# Altium schematic sheet [18] - PCIE MINI.SchDoc
size A2; DocumentNumber: 18; SheetNumber: 18; SheetTotal: 31
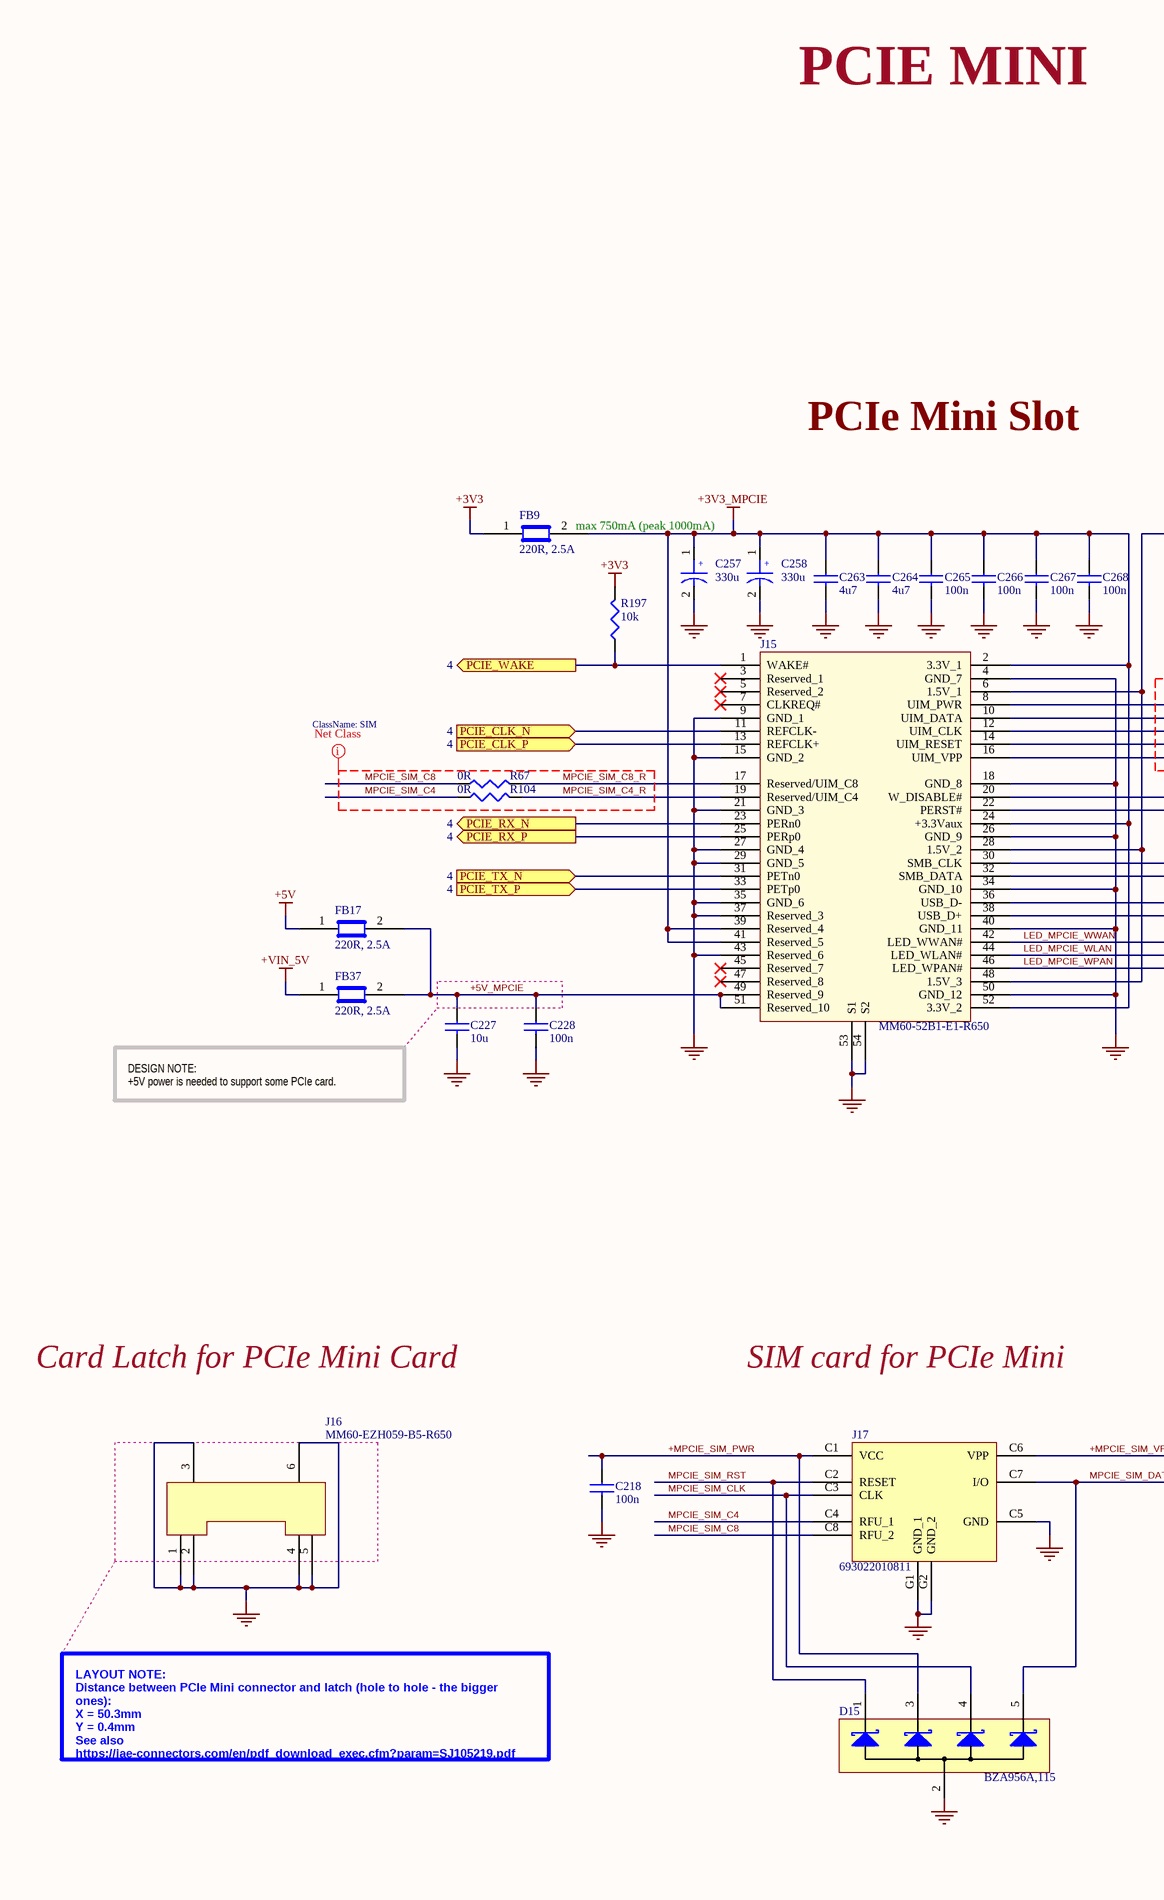
[diagram p0: [18] - PCIE MINI.SchDoc, left]
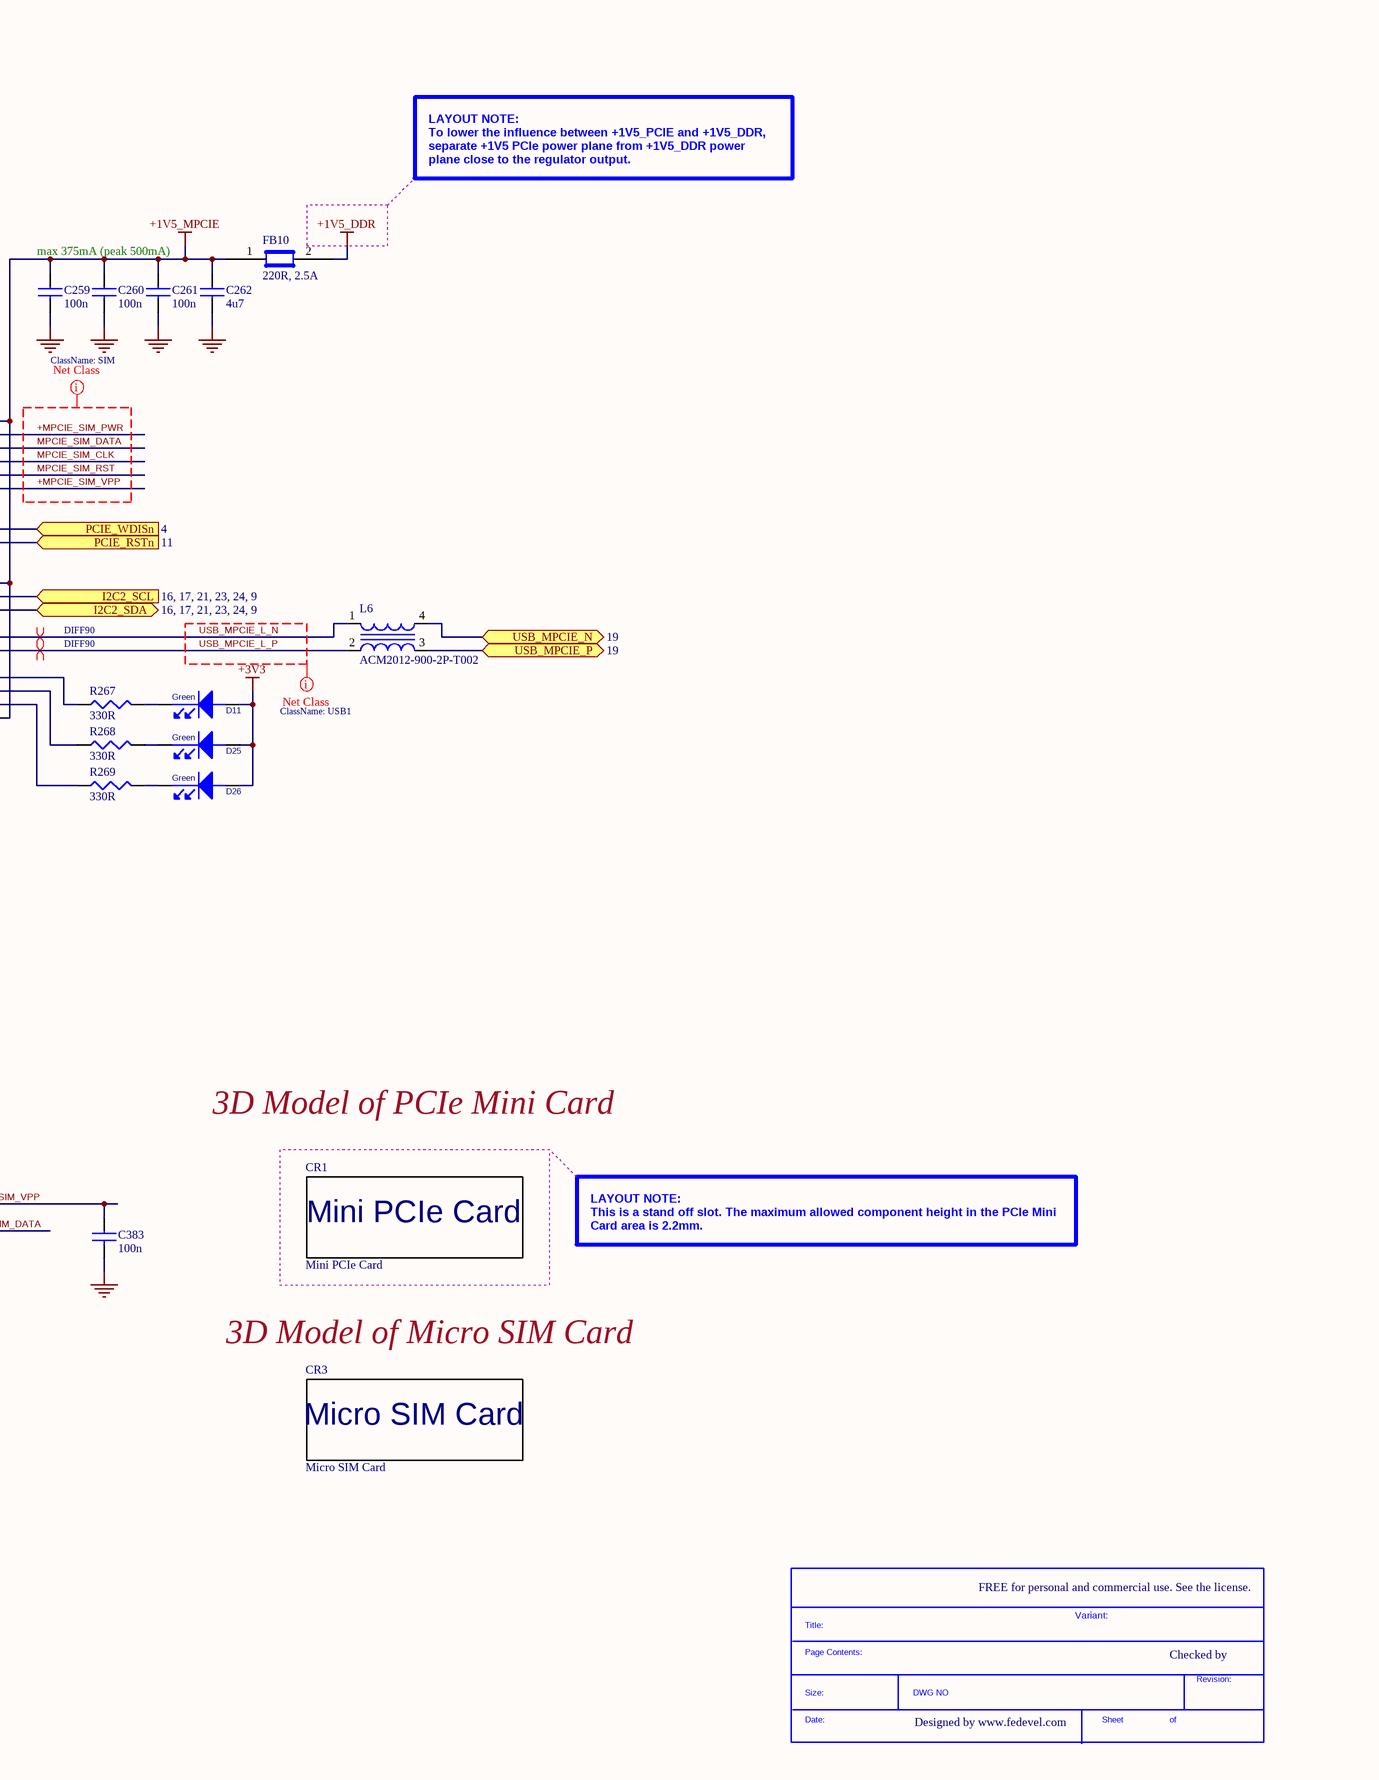
[diagram p1: [18] - PCIE MINI.SchDoc, right]

## Parts
*  SDTitleBlock  (value not drawn)  (graphical)
C218  100n  [C0402]
C227  10u  [C0603]
C228  100n  [C0402]
C257  330u  [C2917]
C258  330u  [C2917]
C259  100n  [C0402]
C260  100n  [C0402]
C261  100n  [C0402]
C262  4u7  [C0402]
C263  4u7  [C0402]
C264  4u7  [C0402]
C265  100n  [C0402]
C266  100n  [C0402]
C267  100n  [C0402]
C268  100n  [C0402]
C383  100n  [C0402]
CR1  Mini PCIe Card  [Mini_PCIe_full card]  (no BOM)
CR3  Micro SIM Card  [Micro_Sim_card]  (no BOM)
D11  Green  [LED_0603]
D15  BZA956A,115  [SOT665]
D25  Green  [LED_0603]
D26  Green  [LED_0603]
FB9  220R, 2.5A  [C0603]
FB10  220R, 2.5A  [C0603]
FB17  220R, 2.5A  [C0603]
FB37  220R, 2.5A  [C0603]
J15  MM60-52B1-E1-R650  [MINI_PCIE_52PIN_CARD_CON]
J16  MM60-EZH059-B5-R650  [MINI_PCIE_52PIN_CARD_LATCH]
J17  693022010811  [SIM_MICRO_HINGED]
L6  ACM2012-900-2P-T002  [ACM2012]
R67  0R  [R0402]
R104  0R  [R0402]
R197  10k  [R0402]
R267  330R  [R0402]
R268  330R  [R0402]
R269  330R  [R0402]

## Ports
I2C2_SCL (see 16, 17, 21, 23, 24, 9), I2C2_SDA (bidir, see 16, 17, 21, 23, 24, 9), PCIE_CLK_N (in, see 4), PCIE_CLK_P (in, see 4), PCIE_RSTn (in, see 11), PCIE_RX_N (out, see 4), PCIE_RX_P (out, see 4), PCIE_TX_N (in, see 4), PCIE_TX_P (in, see 4), PCIE_WAKE (out, see 4), PCIE_WDISn (in, see 4), USB_MPCIE_N (bidir, see 19), USB_MPCIE_P (bidir, see 19)

## Nets
+1V5_DDR: FB10.2
+1V5_MPCIE: C259.1 C260.1 C261.1 C262.1 FB10.1 J15.6(1.5V_1) J15.28(1.5V_2) J15.48(1.5V_3)
+3V3: D11.2(ANODE) D25.2(ANODE) D26.2(ANODE) FB9.1 R197.2
+3V3_MPCIE: C257.1 C258.1 C263.1 C264.1 C265.1 C266.1 C267.1 C268.1 FB9.2 J15.2(3.3V_1) J15.24(+3.3Vaux) J15.39(Reserved_4) J15.41(Reserved_5) J15.52(3.3V_2)
+5V: FB17.1
+VIN_5V: FB37.1
GND: C218.2 C227.2 C228.2 C257.2 C258.2 C259.2 C260.2 C261.2 C262.2 C263.2 C264.2 C265.2 C266.2 C267.2 C268.2 C383.2 D15.2 J15.4(GND_7) J15.9(GND_1) J15.15(GND_2) J15.18(GND_8) J15.21(GND_3) J15.26(GND_9) J15.27(GND_4) J15.29(GND_5) J15.34(GND_10) J15.35(GND_6) J15.37(Reserved_3) J15.40(GND_11) J15.43(Reserved_6) J15.50(GND_12) J15.53(S1) J15.54(S2) J16.1 J16.2 J16.3 J16.4 J16.5 J16.6 J17.C5(GND) J17.G1(GND_1) J17.G2(GND_2)
+5V_MPCIE: C227.1 C228.1 FB17.2 FB37.2 J15.49(Reserved_9) J15.51(Reserved_10)
+MPCIE_SIM_PWR: C218.1 D15.3 J15.8(UIM_PWR) J17.C1(VCC)
+MPCIE_SIM_VPP: C383.1 J15.16(UIM_VPP) J17.C6(VPP)
I2C2_SCL: J15.30(SMB_CLK) ; port I2C2_SCL
I2C2_SDA: J15.32(SMB_DATA) ; port I2C2_SDA
LED_MPCIE_WLAN: J15.44(LED_WLAN#) R268.1
LED_MPCIE_WPAN: J15.46(LED_WPAN#) R269.1
LED_MPCIE_WWAN: J15.42(LED_WWAN#) R267.1
MPCIE_SIM_C4: J17.C4(RFU_1) R104.1
MPCIE_SIM_C4_R: J15.19(Reserved/UIM_C4) R104.2
MPCIE_SIM_C8: J17.C8(RFU_2) R67.1
MPCIE_SIM_C8_R: J15.17(Reserved/UIM_C8) R67.2
MPCIE_SIM_CLK: D15.4 J15.12(UIM_CLK) J17.C3(CLK)
MPCIE_SIM_DATA: D15.5 J15.10(UIM_DATA) J17.C7(I/O)
MPCIE_SIM_RST: D15.1 J15.14(UIM_RESET) J17.C2(RESET)
PCIE_CLK_N: J15.11(REFCLK-) ; port PCIE_CLK_N
PCIE_CLK_P: J15.13(REFCLK+) ; port PCIE_CLK_P
PCIE_RSTn: J15.22(PERST#) ; port PCIE_RSTn
PCIE_RX_N: J15.23(PERn0) ; port PCIE_RX_N
PCIE_RX_P: J15.25(PERp0) ; port PCIE_RX_P
PCIE_TX_N: J15.31(PETn0) ; port PCIE_TX_N
PCIE_TX_P: J15.33(PETp0) ; port PCIE_TX_P
PCIE_WAKE: J15.1(WAKE#) R197.1 ; port PCIE_WAKE
PCIE_WDISn: J15.20(W_DISABLE#) ; port PCIE_WDISn
USB_MPCIE_L_N: J15.36(USB_D-) L6.1
USB_MPCIE_L_P: J15.38(USB_D+) L6.2
USB_MPCIE_N: L6.4 ; port USB_MPCIE_N
USB_MPCIE_P: L6.3 ; port USB_MPCIE_P
NetD11_1: D11.1(cathode) R267.2
NetD25_1: D25.1(cathode) R268.2
NetD26_1: D26.1(cathode) R269.2

Not connected (* = marked no-connect by the designer): J15 3(Reserved_1)* 5(Reserved_2)* 7(CLKREQ#)* 45(Reserved_7)* 47(Reserved_8)*

## Layout directives
differential pair; net class DIFF90: USB_MPCIE_L_N, USB_MPCIE_L_P
net class USB1: USB_MPCIE_L_N, USB_MPCIE_L_P
net class SIM: +MPCIE_SIM_PWR, +MPCIE_SIM_VPP, MPCIE_SIM_C4, MPCIE_SIM_C4_R, MPCIE_SIM_C8, MPCIE_SIM_C8_R, MPCIE_SIM_CLK, MPCIE_SIM_DATA, MPCIE_SIM_RST

## Notes on the sheet
- PCIE MINI
- PCIe Mini Slot
- LAYOUT NOTE:
  To lower the influence between +1V5_PCIE and +1V5_DDR, separate +1V5 PCIe power plane from +1V5_DDR power plane close to the regulator output.
- max 750mA (peak 1000mA)
- max 375mA (peak 500mA)
- DESIGN NOTE:
  +5V power is needed to support some PCIe card.
- Card Latch for PCIe Mini Card
- SIM card for PCIe Mini
- 3D Model of PCIe Mini Card
- LAYOUT NOTE:
  This is a stand off slot. The maximum allowed component height in the PCIe Mini Card area is 2.2mm.
- 3D Model of Micro SIM Card
- LAYOUT NOTE:
  Distance between PCIe Mini connector and latch (hole to hole - the bigger ones):
  X = 50.3mm
  Y = 0.4mm
  See also https://jae-connectors.com/en/pdf_download_exec.cfm?param=SJ105219.pdf
- FREE for personal and commercial use. See the license.
- Variant:
- Checked by
- Designed by www.fedevel.com
- (in symbol SDTitleBlock) Title:; Page Contents:; Revision:; Size:; DWG NO; Date:; Sheet; of
- (in symbol T520D337M006ATE045) +

## Library data of the parts
C218 C228 C259-C261 C265-C268 C383 = C1005X5R1H104K: CAP CER .10UF 50V X5R 10% 0402; Manufacturer: TDK Corporation; Capacitance: 0.1µF; Value: 100nF; .Checked PCB: used; Category: Capacitors; Supplier Part Number: 445-5942-1-ND; Manufacturer Part Number: C1005X5R1H104K; Operating Temperature: -55°C ~ 85°C; Package / Case: 0402 (1005 Metric); Price 1k [$]: 0.02340; .Checked SCH: used; Voltage - Rated: 50V; Supplier: Digikey; Supplier 1: Digi-Key; Supplier Part Number 1: 445-5942-1-ND; RoHS: RoHS Compliant; Stock 1: 106926; Pricing 1: 1=0.27, 10=0.18, 100=0.072, 250=0.05176, 500=0.0369, 1000=0.027 (USD); Tolerance: ±10%; Temperature Coefficient: X5R; Mounting Type: Surface Mount, MLCC; Applications: General Purpose; Ratings: -; Size / Dimension: 0.039" L x 0.020" W (1.00mm x 0.50mm); Height - Seated (Max): -; Thickness (Max): 0.022" (0.55mm); Lead Spacing: -; Features: -; Packaging: Cut Tape (CT); Lead Style: -; ComponentLink1URL: http://www.tdk.co.jp/tefe02/e412_c.pdf; ComponentLink1Description: http://www.tdk.co.jp/tefe02/e412_c.pdf
C227 = C1608X5R0J106M: CAP CER 10UF 6.3V X5R 20% 0603; Manufacturer: TDK Corporation; Capacitance: 10µF; Value: 10µF; .Checked PCB: used; Category: Capacitors; Supplier Part Number: 445-4112-1-ND; Manufacturer Part Number: C1608X5R0J106M; Operating Temperature: -55°C ~ 85°C; Package / Case: 0603 (1608 Metric); Price 1k [$]: 0.08580; .Checked SCH: used; Voltage - Rated: 6.3V; Features: Low ESR; Supplier: Digikey; Supplier 1: Digi-Key; Supplier Part Number 1: 445-4112-1-ND; RoHS: RoHS Compliant; Stock 1: 48157; Pricing 1: 1=0.46, 10=0.363, 100=0.1898, 250=0.14024, 500=0.1089, 1000=0.0858 (USD); Tolerance: ±20%; Temperature Coefficient: X5R; Mounting Type: Surface Mount, MLCC; Applications: General Purpose; Ratings: -; Size / Dimension: 0.063" L x 0.031" W (1.60mm x 0.80mm); Height - Seated (Max): -; Thickness (Max): 0.037" (0.95mm); Lead Spacing: -; Packaging: Cut Tape (CT); Lead Style: -; ComponentLink1URL: http://www.tdk.com/pdf/general_B11.pdf; ComponentLink1Description: http://www.tdk.com/pdf/general_B11.pdf
C257 C258 = T520D337M006ATE045: CAP TANT 330UF 6.3V 20% 2917; Manufacturer: Kemet; Manufacturer Size Code: D; Capacitance: 330µF; ESR (Equivalent Series Resistance): 45 mOhm; Type: Molded; .Creator: MM; .Checked PCB: used; Supplier 1: Digi-Key; Manufacturer Part Number: T520D337M006ATE045; RoHS: RoHS Compliant; Category: Capacitors; Stock 1: 11758; Pricing 1: 1=1.33, 10=1.05, 50=0.91, 100=0.7875, 250=0.7 (USD); Packaging: Cut Tape (CT); Voltage - Rated: 6.3V; Tolerance: ±20%; Operating Temperature: -55°C ~ 105°C; Mounting Type: Surface Mount; Package / Case: 2917 (7343 Metric); Size / Dimension: 0.287" L x 0.169" W (7.30mm x 4.30mm); Height - Seated (Max): 0.122" (3.10mm); Lead Spacing: -; Features: Polymer; Lifetime @ Temp.: -; ComponentLink1URL: http://www.kemet.com/kemet/web/homepage/kechome.nsf/file/T520%20Series/$file/KEM_T2015_T520.pdf; ComponentLink1Description: http://www.kemet.com/kemet/web/homepage/kechome.nsf/file/T520%20Series/$file/KEM_T2015_T520.pdf; Supplier Part Number 1: 399-4055-1-ND; .Checked SCH: used
C262-C264 = C1005X5R1A475M: CAP CER 4.7UF 10V 20% X5R 0402; Manufacturer: TDK Corporation; Capacitance: 4.7µF; .Checked PCB: used; Supplier 1: Digi-Key; Supplier Part Number 1: 445-8023-1-ND; Manufacturer Part Number: C1005X5R1A475M; RoHS: RoHS Compliant; Category: Capacitors; Stock 1: 10140; Pricing 1: 1=0.53, 10=0.415, 100=0.25, 250=0.18752, 500=0.16, 1000=0.125, 5000=0.095 (USD); Voltage - Rated: 10V; Tolerance: ±20%; Temperature Coefficient: X5R; Mounting Type: Surface Mount, MLCC; Operating Temperature: -55°C ~ 85°C; Applications: General Purpose; Ratings: -; Package / Case: 0402 (1005 Metric); Size / Dimension: 0.039" L x 0.020" W (1.00mm x 0.50mm); Height - Seated (Max): -; Thickness (Max): -; Lead Spacing: -; Features: -; Packaging: Cut Tape (CT); Lead Style: -; ComponentLink1URL: http://www.tdk.com/pdf/general_B11.pdf; ComponentLink1Description: http://www.tdk.com/pdf/general_B11.pdf; .Checked SCH: used
CR1 = Card_Mini_PCIe: Card MIni PCIe; .Creator: MM; Category: Card
CR3 = Card_Micro_SIM: Card Micro SIM; .Creator: MM; Category: Card
D11 D25 D26 = LG L29K-G2J1-24-Z: LED SMARTLED GREEN 570NM 0603; Manufacturer: OSRAM Opto Semiconductors Inc; .Checked PCB: used; Current - Test: 2mA; Voltage - Forward (Vf) Typ: 1.7V; Luminous Flux @ Current - Test: 12 mlm; Millicandela Rating: 3.92mcd; Wavelength - Peak: 572nm; Lens Type: Diffused; Lens Style/Size: Rectangle with Flat Top, 1.3mm x 0.8mm; Viewing Angle: 160°; Regulator Topology: Positive Fixed; Voltage - Output: 2.5V; Voltage - Input: 2.6 V ~ 6 V; Voltage - Dropout (Typical): 0.16V @ 500mA; Number of Regulators: 1; Current - Output: 500mA; Current - Limit (Min): 600mA; .Checked SCH: used; Category: Optoelectronics; Supplier Part Number: 475-2709-1-ND; Family: LEDs - <75mA, Discre; Manufacturer Part Number: LG L29K-G2J1-24-Z; Price 1k [$]: 0.08744; Value: Green; Color: Green; Package / Case: 0603 (1608 Metric); Supplier: Digikey; Supplier 1: Digi-Key; Supplier Part Number 1: 475-2709-1-ND; RoHS: RoHS Compliant; Stock 1: 30318; Pricing 1: 1=0.16, 10=0.137, 100=0.1093, 250=0.09564, 500=0.08744 (USD); Wavelength - Dominant: 570nm; Size / Dimension: 1.70mm L x 0.80mm W; Height: 0.65mm; Mounting Type: Surface Mount; Packaging: Cut Tape (CT); ComponentLink1URL: http://catalog.osram-os.com/catalogue/catalogue.do;jsessionid=32CB61882C089EDD4B6D0A54E7E1F117?act=downloadFile&favOid=020000020000138e000100b6; ComponentLink1Description: http://catalog.osram-os.com/catalogue/catalogue.do;jsessionid=32CB61882C089EDD4B6D0A54E7E1F117?act=downloadFile&favOid=020000020000138e000100b6; Operating Temperature: -40°C ~ 125°C; Supplier Device Package: 6-TMLF® (1.6x1.6); ComponentLink2URL: http://www.micrel.com/_PDF/mic5353.pdf; ComponentLink2Description: http://www.micrel.com/_PDF/mic5353.pdf
D15 = BZA956A,115: TVS ZENER QUAD 5.6V SOT665; Manufacturer: NXP Semiconductors; Voltage - Reverse Standoff (Typ): 3V; Voltage - Breakdown: 5.32V; Power (Watts): 16W; Polarization: 4 Channel Array - Unidirectional; .Creator: MM; .Checked PCB: used; Supplier 1: Digi-Key; Manufacturer Part Number: BZA956A,115; RoHS: RoHS Compliant; Category: Circuit Protection; Stock 1: 7740; Pricing 1: 1=0.55, 10=0.386, 25=0.3176, 100=0.2537, 250=0.1848, 500=0.15008, 1000=0.11536 (USD); Packaging: Cut Tape (CT); Mounting Type: Surface Mount; Package / Case: SOT-665; Supplier Device Package: SOT-665; ComponentLink1URL: http://www.nxp.com/documents/data_sheet/BZA900A_SERIES.pdf; ComponentLink1Description: http://www.nxp.com/documents/data_sheet/BZA900A_SERIES.pdf; Supplier Part Number 1: 568-7016-1-ND; .Checked SCH: used
FB9 FB10 FB17 FB37 = BLM18SG221TN1D: FERRITE CHIP 220 OHM 2500MA 0603; Manufacturer: Murata Electronics North America; Impedance @ Frequency: 220 Ohm @ 100MHz; DC Resistance (DCR): 40 mOhm Max; Filter Type: Differential Mode - Single; Number of Lines: 1; .Checked PCB: used; Supplier 1: Digi-Key; Supplier Part Number 1: 490-5225-1-ND; Manufacturer Part Number: BLM18SG221TN1D; RoHS: RoHS Compliant; Category: Filters; Stock 1: 54640; Pricing 1: 1=0.38, 10=0.282, 50=0.1646, 100=0.1316, 250=0.094, 500=0.06392, 1000=0.0517, 5000=0.04042 (USD); Current Rating: 2.5A; Package / Case: 0603 (1608 Metric); Mounting Type: Surface Mount; Packaging: Cut Tape (CT); Height (Max): 0.037" (0.95mm); Size / Dimension: 0.063" L x 0.031" W (1.60mm x 0.80mm); ComponentLink1URL: http://search.murata.co.jp/Ceramy/image/img/PDF/ENG/L0110S0100BLM18S.pdf; ComponentLink1Description: http://search.murata.co.jp/Ceramy/image/img/PDF/ENG/L0110S0100BLM18S.pdf; .Checked SCH: used
J15 = MM60-52B1-E1-R650: CONN MINI EXPRESS CARD 52POS SMD; Manufacturer: JAE Electronics; Card Type: PCI Express Mini Card; Gender: Female; Number of Positions: 52; Card Thickness: 0.039" (1.00mm); Pitch: 0.031" (0.80mm); Material - Insulation: Thermoplastic; Read Out: Dual; .Creator: MM; .Checked PCB: used; Supplier 1: Digi-Key; Manufacturer Part Number: MM60-52B1-E1-R650; RoHS: RoHS Compliant; Category: Connectors, Interconnects; Stock 1: 470; Pricing 1: 1=2.16, 10=1.962, 25=1.842, 100=1.6817, 250=1.52152 (USD); Packaging: Cut Tape (CT); Number of Positions/Bay/Row: -; Number of Rows: 2; Features: Board Guide; Mounting Type: Surface Mount, Right Angle; Termination: Solder; Contact Material: Copper Alloy; Contact Finish: Gold; Contact Finish Thickness: 4µin (0.10µm); Contact Type: -; Color: -; Flange Feature: -; Operating Temperature: -40°C ~ 85°C; ComponentLink1URL: http://jae-connectors.com/en/pdf/JACS-10313_MM60.pdf; ComponentLink1Description: http://jae-connectors.com/en/pdf/JACS-10313_MM60.pdf; Supplier Part Number 1: 670-2275-1-ND; .Checked SCH: used
J16 = MM60-EZH059-B5-R650: CONN MINI EXPRESS CARD LATCH SMD; Manufacturer: JAE Electronics; For Use With/Related Products: PCI Express Mini Card; .Creator: MM; .Checked PCB: used; Supplier 1: Digi-Key; Manufacturer Part Number: MM60-EZH059-B5-R650; RoHS: RoHS Compliant; Category: Connectors, Interconnects; Stock 1: 4853; Pricing 1: 1=1.22, 10=1.075, 25=1.0116, 100=0.9272, 250=0.84292 (USD); Packaging: Cut Tape (CT); Accessory Type: Latch; ComponentLink1URL: http://jae-connector.com/en/pdf/SJ105221.pdf; ComponentLink1Description: http://jae-connector.com/en/pdf/SJ105221.pdf; Supplier Part Number 1: 670-2277-1-ND; .Checked SCH: used
J17 = 693022010811: CONN SMART CARD; Manufacturer: Wurth Electronics Inc; Card Type: Micro SIM; Number of Positions: 8; Connector Type: Connector and Ejector; Insertion, Removal Method: Hinged Lid; .Creator: MM; Supplier 1: Digi-Key; Manufacturer Part Number: 693022010811; RoHS: RoHS Compliant; Category: Connectors, Interconnects; Stock 1: 1977; Pricing 1: 1=1.94, 10=1.74, 50=1.61, 100=1.48, 500=1.29 (USD); Packaging: Cut Tape (CT); Ejector Side: -; Mounting Type: Surface Mount, Right Angle; Features: Shielded; Height Above Board: 0.077" (1.95mm); Mounting Feature: Normal, Standard - Top; Contact Finish: Gold; Contact Finish Thickness: -; ComponentLink1URL: http://katalog.we-online.de/em/datasheet/693022010811.pdf; ComponentLink1Description: http://katalog.we-online.de/em/datasheet/693022010811.pdf; Supplier Part Number 1: 732-5957-1-ND; .Checked PCB: MM; .Checked SCH: MM
L6 = ACM2012-900-2P-T002: CHOKE COMM MODE 90 OHM .4A SMD; Manufacturer: TDK Corporation; Filter Type: Data, Signal Line; Number of Lines: 2; Current: 400mA; DC Resistance (DCR): 190 mOhm Max; Impedance: 90 Ohm; Resistance (Ohms): 8.2K; Power (Watts): 0.063W, 1/16W; Temperature Coefficient: ±100ppm/°C; Tolerance: ±1%; .Checked PCB: used; Supplier 1: Digi-Key; Supplier Part Number 1: 445-2207-1-ND; Manufacturer Part Number: ACM2012-900-2P-T002; RoHS: RoHS Compliant; Category: Filters; Stock 1: 175768; Pricing 1: 1=0.48, 10=0.448, 50=0.42, 100=0.364, 500=0.308, 1000=0.252 (USD); Inductance: -; Mounting Type: Surface Mount; Size / Dimension: 0.079" L x 0.047" W (2.00mm x 1.20mm); Height (Max): 0.051" (1.30mm); Package / Case: 0805 (2012 Metric), 4 Lead; Operating Temperature: -25°C ~ 85°C; Packaging: Cut Tape (CT); ComponentLink1URL: http://www.tdk.co.jp/tefe02/e9719_acm2012.pdf; ComponentLink1Description: http://www.tdk.co.jp/tefe02/e9719_acm2012.pdf; Composition: Thick Film; Features: -; Height: 0.016" (0.40mm); Number of Terminations: 2; ComponentLink2URL: http://www.yageo.com/documents/recent/PYu-RC0402_51_RoHS_L_6.pdf; ComponentLink2Description: http://www.yageo.com/documents/recent/PYu-RC0402_51_RoHS_L_6.pdf; .Checked SCH: used
R67 R104 = RC0402JR-070RL: RES 0.0 OHM 1/16W 0402 SMD; Manufacturer: Yageo; Resistance (Ohms): 0.0; Power (Watts): 0.063W, 1/16W; Tolerance: Jumper; .Checked PCB: used; Category: Resistors; Manufacturer Part Number: RC0402JR-070RL; Package / Case: 0402 (1005 Metric); Price 1k [$]: 0.01389; Value: 0R; .Checked SCH: used; Supplier Part Number: 311-0.0JRCT-ND; Supplier: Digikey; Supplier 1: Digi-Key; Supplier Part Number 1: 311-0.0JRCT-ND; RoHS: RoHS Compliant; Stock 1: 1106330; Pricing 1: 10=0.012, 50=0.009, 100=0.0069, 250=0.00512, 500=0.0038, 1000=0.00253 (USD); Composition: Thick Film; Features: -; Temperature Coefficient: -; Size / Dimension: 0.039" L x 0.020" W (1.00mm x 0.50mm); Height: 0.016" (0.40mm); Number of Terminations: 2; Packaging: Cut Tape (CT); ComponentLink1URL: http://www.yageo.com/documents/recent/PYu-RC0402_51_RoHS_L_6.pdf; ComponentLink1Description: http://www.yageo.com/documents/recent/PYu-RC0402_51_RoHS_L_6.pdf
R197 = RC0402FR-0710KL: RES 10.0K OHM 1/16W 1% 0402 SMD; Manufacturer: Yageo; Power (Watts): 0.063W, 1/16W; .Checked PCB: used; Temperature Coefficient: ±100ppm/°C; Category: Resistors; Supplier Part Number: 311-10.0KLRCT-ND; Manufacturer Part Number: RC0402FR-0710KL; Package / Case: 0402 (1005 Metric); Price 1k [$]: 0.01421; Resistance (Ohms): 10K; Tolerance: ±1%; Value: 10k; .Checked SCH: used; Supplier: Digikey; Supplier 1: Digi-Key; Supplier Part Number 1: 311-10.0KLRCT-ND; RoHS: RoHS Compliant; Stock 1: 2916495; Pricing 1: 10=0.014, 50=0.0104, 100=0.0079, 250=0.00584, 500=0.00432, 1000=0.00288 (USD); Composition: Thick Film; Features: -; Size / Dimension: 0.039" L x 0.020" W (1.00mm x 0.50mm); Height: 0.016" (0.40mm); Number of Terminations: 2; Packaging: Cut Tape (CT); ComponentLink1URL: http://www.yageo.com/documents/recent/PYu-RC0402_51_RoHS_L_6.pdf; ComponentLink1Description: http://www.yageo.com/documents/recent/PYu-RC0402_51_RoHS_L_6.pdf
R267-R269 = CRCW0402330RFKED: RES 330 OHM 1/16W 1% 0402 SMD; Manufacturer: Vishay Dale; Resistance (Ohms): 330; Power (Watts): 0.063W, 1/16W; Temperature Coefficient: ±100ppm/°C; .Checked PCB: used; Supplier 1: Digi-Key; Supplier Part Number 1: 541-330LCT-ND; Manufacturer Part Number: CRCW0402330RFKED; RoHS: RoHS Compliant; Category: Resistors; Stock 1: 49303; Pricing 1: 10=0.083, 50=0.0444, 200=0.0255, 1000=0.0174 (USD); Composition: Thick Film; Features: -; Tolerance: ±1%; Package / Case: 0402 (1005 Metric); Size / Dimension: 0.039" L x 0.020" W (1.00mm x 0.50mm); Height: 0.016" (0.40mm); Number of Terminations: 2; Packaging: Cut Tape (CT); ComponentLink1URL: http://www.vishay.com/doc?20035; ComponentLink1Description: http://www.vishay.com/doc?20035; .Checked SCH: used